# Altium schematic sheet EmbeddedPeripherals.SchDoc: Embedded Sensors
size A4; Engineer: David; DocumentNumber: 7; SheetNumber: 7; SheetTotal: 9; Project: SmartCanton Dev Box; Labo: LSN; PageSetup: Record=PageOptions|CenterHorizontal=True|CenterVertical=True|PrintScale=0.97|XCorrection=1.00|YCorrection=1.00|PrintKind=1|BorderSize=5000000|LeftOffset=0|BottomOffset=0|Orientation=2|PaperLength=1000|PaperWidth=1000|Scale=100|PaperSource=7|PrintQuality=-3|MediaType=1|DitherType=10|PrintScaleMode=1|PaperKind=A4 (210 x 297 mm)|PaperIndex=9
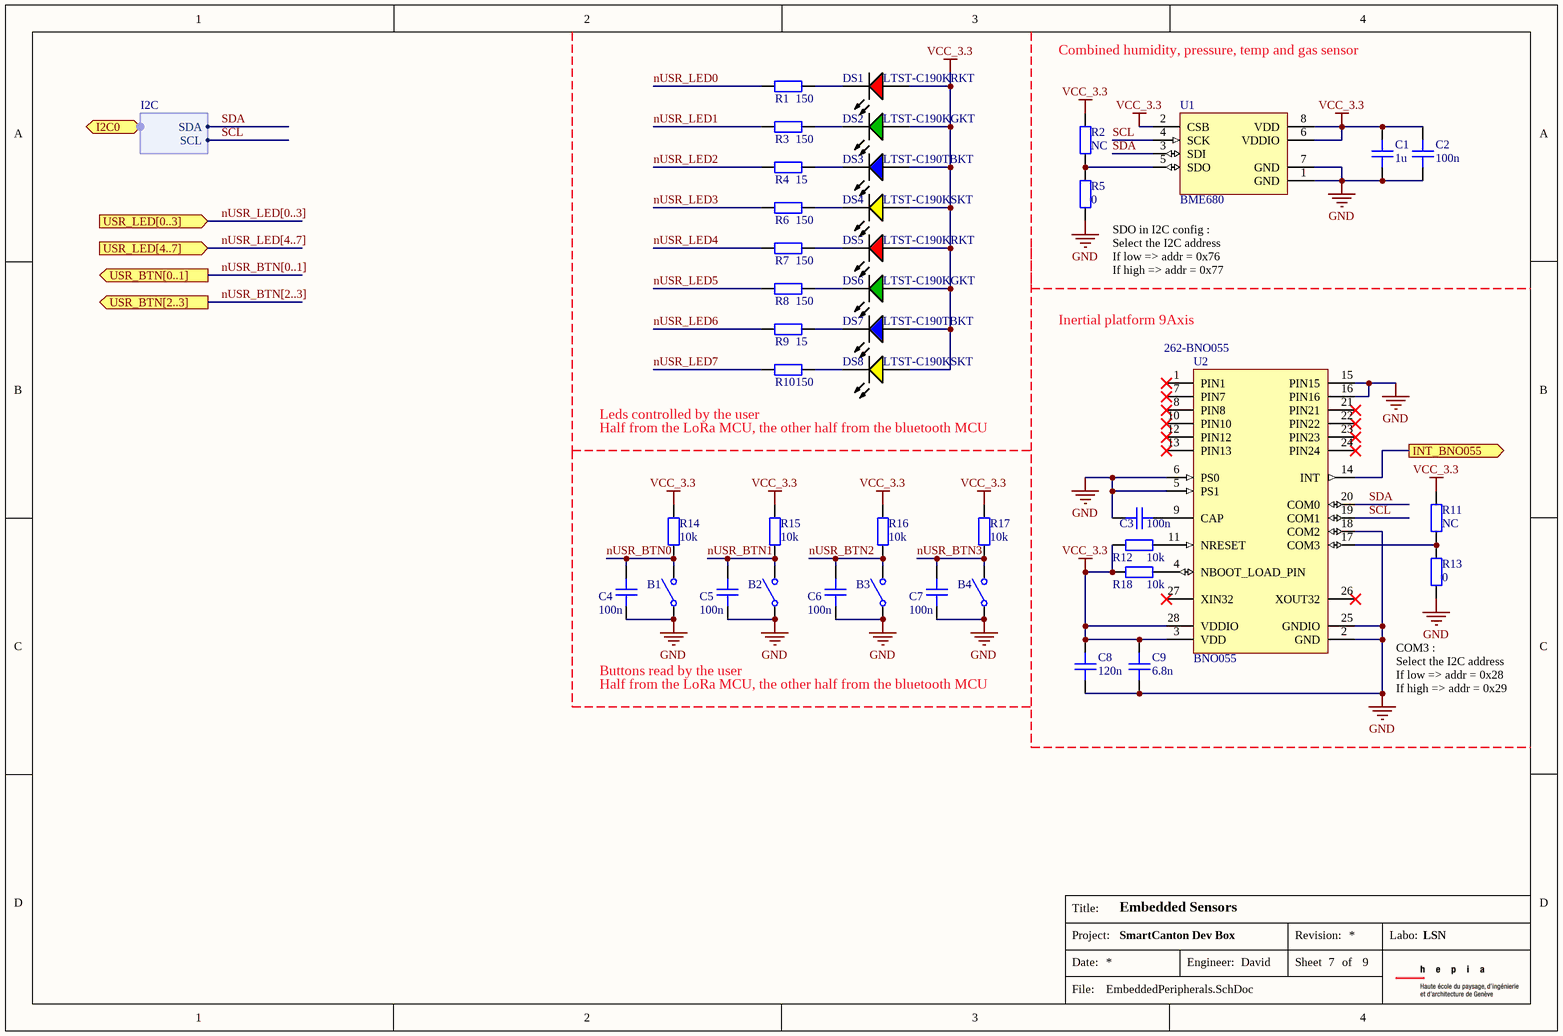
[diagram p0: EmbeddedPeripherals.SchDoc]

## Parts
B1  653-B3U-1000P  [B3U-1000P]  (value not drawn)
B2  653-B3U-1000P  [B3U-1000P]  (value not drawn)
B3  653-B3U-1000P  [B3U-1000P]  (value not drawn)
B4  653-B3U-1000P  [B3U-1000P]  (value not drawn)
C1  1u  [CAPC1608X08]
C2  100n  [CAPC1608X08]
C3  100n  [CAPC1608X08]
C4  100n  [CAPC1608X08]
C5  100n  [CAPC1608X08]
C6  100n  [CAPC1608X08]
C7  100n  [CAPC1608X08]
C8  120n  [CAPC1608X08]
C9  6.8n  [CAPC1608X08]
DS1  LTST-C190KRKT  [LTST-C191KRKT_V]
DS2  LTST-C190KGKT  [LITE-ON-LTST-C190GKT-2_V]
DS3  LTST-C190TBKT  [LTST-C190TBKT-2_V]
DS4  LTST-C190KSKT  [LTST-C190KSKT_V]
DS5  LTST-C190KRKT  [LTST-C191KRKT_V]
DS6  LTST-C190KGKT  [LITE-ON-LTST-C190GKT-2_V]
DS7  LTST-C190TBKT  [LTST-C190TBKT-2_V]
DS8  LTST-C190KSKT  [LTST-C190KSKT_V]
R1  150  [RESC1608X06]
R2  NC  [RESC1608X06]
R3  150  [RESC1608X06]
R4  15  [RESC1608X06]
R5  0  [RESC1608X06]
R6  150  [RESC1608X06]
R7  150  [RESC1608X06]
R8  150  [RESC1608X06]
R9  15  [RESC1608X06]
R10  150  [RESC1608X06]
R11  NC  [RESC1608X06]
R12  10k  [RESC1608X06]
R13  0  [RESC1608X06]
R14  10k  [RESC1608X06]
R15  10k  [RESC1608X06]
R16  10k  [RESC1608X06]
R17  10k  [RESC1608X06]
R18  10k  [RESC1608X06]
U1  BME680  [LGA-8-30x30x09]
U2  BNO055  Supplier Part Number 1: 262-BNO055  [BOSC-LGA-28_N]

## Ports
I2C0 (harness I2C), INT_BNO055 (out), USR_BTN[0..1] (out), USR_BTN[2..3] (out), USR_LED[0..3] (in), USR_LED[4..7] (in)

## Harnesses
I2C: SCL, SDA

## Nets
GND: B1.1 B2.1 B3.1 B4.1 C1.1 C2.1 C3.2 C4.2 C5.2 C6.2 C7.2 C8.1 C9.1 R5.1 R13.1 U1.1(GND) U1.7(GND) U2.2(GND) U2.5(PS1) U2.6(PS0) U2.15(PIN15) U2.16(PIN16) U2.18(COM2) U2.25(GNDIO)
VCC_3.3: C1.2 C2.2 C8.2 C9.2 DS1.1(A) DS2.1(A) DS3.1(A) DS4.1(A) DS5.1(A) DS6.1(A) DS7.1(A) DS8.1(A) R2.2 R11.2 R12.1 R14.2 R15.2 R16.2 R17.2 R18.1 U1.2(CSB) U1.6(VDDIO) U1.8(VDD) U2.3(VDD) U2.28(VDDIO)
INT_BNO055: U2.14(INT) ; port INT_BNO055
nUSR_BTN0: B1.2 C4.1 R14.1
nUSR_BTN1: B2.2 C5.1 R15.1
nUSR_BTN2: B3.2 C6.1 R16.1
nUSR_BTN3: B4.2 C7.1 R17.1
nUSR_LED0: R1.1
nUSR_LED1: R3.1
nUSR_LED2: R4.1
nUSR_LED3: R6.1
nUSR_LED4: R7.1
nUSR_LED5: R8.1
nUSR_LED6: R9.1
nUSR_LED7: R10.1
SCL: U1.4(SCK) U2.19(COM1) ; port I2C0.SCL
SDA: U1.3(SDI) U2.20(COM0) ; port I2C0.SDA
NetC3_1: C3.1 U2.9(CAP)
NetDS1_2: DS1.2(K) R1.2
NetDS2_2: DS2.2(K) R3.2
NetDS3_2: DS3.2(K) R4.2
NetDS4_2: DS4.2(K) R6.2
NetDS5_2: DS5.2(K) R7.2
NetDS6_2: DS6.2(K) R8.2
NetDS7_2: DS7.2(K) R9.2
NetDS8_2: DS8.2(K) R10.2
NetR2_1: R2.1 R5.2 U1.5(SDO)
NetR11_1: R11.1 R13.2 U2.17(COM3)
NetR12_2: R12.2 U2.11(NRESET)
NetR18_2: R18.2 U2.4(NBOOT_LOAD_PIN)

Not connected (* = marked no-connect by the designer): U2 1(PIN1)* 7(PIN7)* 8(PIN8)* 10(PIN10)* 12(PIN12)* 13(PIN13)* 21(PIN21)* 22(PIN22)* 23(PIN23)* 24(PIN24)* 26(XOUT32)* 27(XIN32)*

## Buses and harness runs
bus nUSR_BTN[0..1] = port USR_BTN[0..1]
bus nUSR_BTN[2..3] = port USR_BTN[2..3]
bus nUSR_LED[0..3] = port USR_LED[0..3]
bus nUSR_LED[4..7] = port USR_LED[4..7]

## Notes on the sheet
- Combined humidity, pressure, temp and gas sensor
- SDO in I2C config :
  Select the I2C address
  If low => addr = 0x76
  If high => addr = 0x77
- Inertial platform 9Axis
- (near R10) Leds controlled by the user
- Half from the LoRa MCU, the other half from the bluetooth MCU
- Buttons read by the user
- (near C8) Half from the LoRa MCU, the other half from the bluetooth MCU
- COM3 :
  Select the I2C address
  If low => addr = 0x28
  If high => addr = 0x29
- Title:
- Date:
- Project:
- Engineer:
- Revision:
- Sheet
- of
- Labo:
- File:

## Library data of the parts
B1-B4 = PUSH_BUTTON: Supplier 1: Mouser; Supplier Part Number 1: 653-B3U-1000P
C1 C2 = CMP-001-0010-A.3: MLCC Capacitor 1608; AccessRights: 2147483647; ContentType: Component; Folder: LSN\Components\Passifs\Condensateurs\; RevisionId: A.2; ComponentType: Capacitor; ContentTypeGUID: CB3C11C4-E317-11DF-B822-12313F0024A2; FolderGUID: 9DA6C5B0-B134-4C0D-99DA-A840DED25FBD; ItemGUID: 6B05C9AF-D3C2-4723-98C2-0E51694C471A; ItemHRID: CMP-001-0010; LifeCycle: New From Design; LifeCycleStateGUID: 706004B5-C76E-482E-903B-BA0E4FAE086A; ReleaseDate: 31/10/2016 02:21:03 PM
  C1: Value: 1u
  C2: Value: 100n
C3-C9 = CMP-001-0010-A.3: MLCC Capacitor 1608; RevisionId: A.2; AccessRights: 2147483647; Folder: LSN\Components\Passifs\Condensateurs\; ContentType: Component; LifeCycleStateGUID: 706004B5-C76E-482E-903B-BA0E4FAE086A; ReleaseDate: 31/10/2016 02:21:03 PM; ContentTypeGUID: CB3C11C4-E317-11DF-B822-12313F0024A2; ItemGUID: 6B05C9AF-D3C2-4723-98C2-0E51694C471A; ItemHRID: CMP-001-0010; FolderGUID: 9DA6C5B0-B134-4C0D-99DA-A840DED25FBD; LifeCycle: New From Design; ComponentType: Capacitor
  C3-C7: Value: 100n
  C8: Value: 120n
  C9: Value: 6.8n
DS1 DS5 = CMP-00027-A.1: LED Uni-Color Red, 62.5 mW, 5 V, -30 to 85 degC, 2-Pin SMD, RoHS, Tape and Reel; Capacitance: 100 uF; Voltage Rating: 50 V; Case\Package: Radial; Tolerance: 20%; Packaging: Bulk; REACH SVHC: No SVHC; ComponentLink1Description: Manufacturer URL; ComponentLink2URL: http://optoelectronics.liteon.com/upload/download/DS-22-99-0151/S_110_LTST-C190KRKT.pdf; Max Operating Temperature: 85 degC; DatasheetVersion: Rev. F, 05/2013; Pins: 2; Voltage Rating (DC): 50 V; Mount: Through Hole; Lead Pitch: 3.5 mm; Diameter: 8 mm; ComponentLink1URL: http://www.us.liteon.com/; Radiation Hardening: No; Package Quantity: 200; PackageReference: C191KRKT; RoHSCompliant: true; Height: 11.5 mm; PackageDescription: 2-Pin Surface Mount Device, Body 1.6 x 0.8 mm; Length: 11.5 mm; ComponentLink2Description: Datasheet; Min Operating Temperature: -40 degC; Supplier 1: Mouser; Supplier Part Number 1: 859-LTST-C190KRKT
DS2 DS6 = CMP-00026-A.1: LED Uni-Color Green, 75 mW, 5 V, -30 to 85 degC, 2-Pin SMD, RoHS, Tape and Reel; Manufacturer: Lite-On; Reverse Voltage: 5V; Product Depth (mm): 0.8mm; Forward Voltage: 2.4V; Rad Hardened: No; High Brightness: Yes; Forward Current: 30mA; Viewing Angle: 130deg; Test Current (It): 20mA; Emitting Color: YellowGreen; Number of Elements: 1; Luminous Intensity: 35mcd; Chip Material: AlGaInP; Shape Type: Rectangular; Dominant Wave Length: 571nm; Peak Wavelength: 574nm; Main Category: ChipLED; DELETED: Compliant; Product Length (mm): 1.6mm; Power Dissipation: 75W; Package Reference: C190KGKT; Mounting: SurfaceMount; Package Description: 2-Pin Surface Mount Device, Body 1.6 x 0.8 mm; Datasheet Version: Jul-15; Operating Temperature Classification: Industrial; Packaging: TapeandReel; Lens Dimensions: 1.1X0.8X0.52mm; Type: Uni-Color; Manufacturer URL: http://www.us.liteon.com/; Datasheet URL: http://datasheet.octopart.com/LTST-C190KGKT-Lite-On-datasheet-43775815.pdf; Product Height (mm): 0.8mm; Operating Temp Range: -55Cto85C; Pin Count: 2; Package Type: ChipLed; Lum Intensity: 35mcd; Supplier 1: Mouser; Supplier Part Number 1: 859-LTST-C190KGKT
DS3 DS7 = CMP-00021-A.1: Single Color Chip LED, 2.8 to 3.8 V, 28 to 180 mcd, -20 to 80 degC, 2-Pin SMD, RoHS, Tape and Reel; Nominal Supply Voltage: 3 V; Min Supply Voltage: 2.1 V; Interface: Serial; Case\Package: DFN; Max Supply Voltage: 3.6 V; Min Operating Temperature: -40 degC; ComponentLink2URL: http://optoelectronics.liteon.com/upload/download/DS-22-99-0224/S_110_LTST-C190TBKT(0630).pdf; Length: 3 mm; PackageReference: C190TBKT-2; Packaging: Cut Tape; RoHSCompliant: true; DatasheetVersion: Rev. K, 08/2011; Width: 3 mm; Pins: 6; Height: 1.1 mm; Max Operating Temperature: 125 degC; Mount: Surface Mount; PackageDescription: 2-Pin Surface Mount Device, Body 1.6 x 0.8 mm; ComponentLink1Description: Manufacturer URL; ComponentLink1URL: http://www.us.liteon.com/; REACH SVHC: No SVHC; ComponentLink2Description: Datasheet; Supplier 1: Mouser; Supplier Part Number 1: 859-LTST-C190TBKT
DS4 DS8 = CMP-00025-A.1: LED Uni-Color Yellow, 75 mW, 30 mA, -30 to 85 degC, 2-Pin SMD, RoHS, Tape and Reel; Voltage Rating: 50 V; Case\Package: 0603; Power Rating: 100 mW; Tolerance: 1%; Resistance: 12 kohm; Packaging: Tape and Reel; RoHSCompliant: true; Height: 0.45 mm; Max Operating Temperature: 155 degC; Mount: Surface Mount; DatasheetVersion: Rev. I, 10/2012; Min Operating Temperature: -55 degC; PackageReference: C190KSKT; ComponentLink1Description: Manufacturer URL; Length: 1.6 mm; REACH SVHC: No SVHC; Case Code (Imperial): 0603; Voltage Rating (DC): 50 V; PackageDescription: 2-Pin Surface Mount Device, Body 1.6 x 0.8 mm; Case Code (Metric): 1608; Package Quantity: 5000; ComponentLink2Description: Datasheet; Width: 0.8 mm; Pins: 2; ComponentLink2URL: http://optoelectronics.liteon.com/upload/download/DS-22-99-0189/S_110_LTST-C190KSKT.pdf; ComponentLink1URL: http://www.us.liteon.com/; Supplier 1: Mouser; Supplier Part Number 1: 859-LTST-C190KSKT
R1-R18 = CMP-001-0005-A.4: 1608 resistor
  R1 R3 R6-R8 R10: Value: 150
  R2 R11: Value: NC
  R4 R9: Value: 15
  R5 R13: Value: 0
  R12 R14-R18: Value: 10k
U1 = CMP-001-0107-A.4: Combined himidity, pressure, temp and gas sensor
U2 = CMP-00007-A.1: Intelligent 9-Axis Absolute Orientation Sensor, 1.7 V to 3.6 V, -40 to 85 degC, 28-Pin LGA, RoHS, Tape and Reel; Manufacturer: Bosch Sensortec; Manufacturer URL: http://www.bosch-sensortec.com; Datasheet URL: http://datasheet.octopart.com/BNO055-Bosch-datasheet-45840915.pdf; Datasheet Version: Rev. 1.3, 08/2015; Supplier 1: Mouser